# Altium schematic sheet Sheet2.SchDoc
size A3
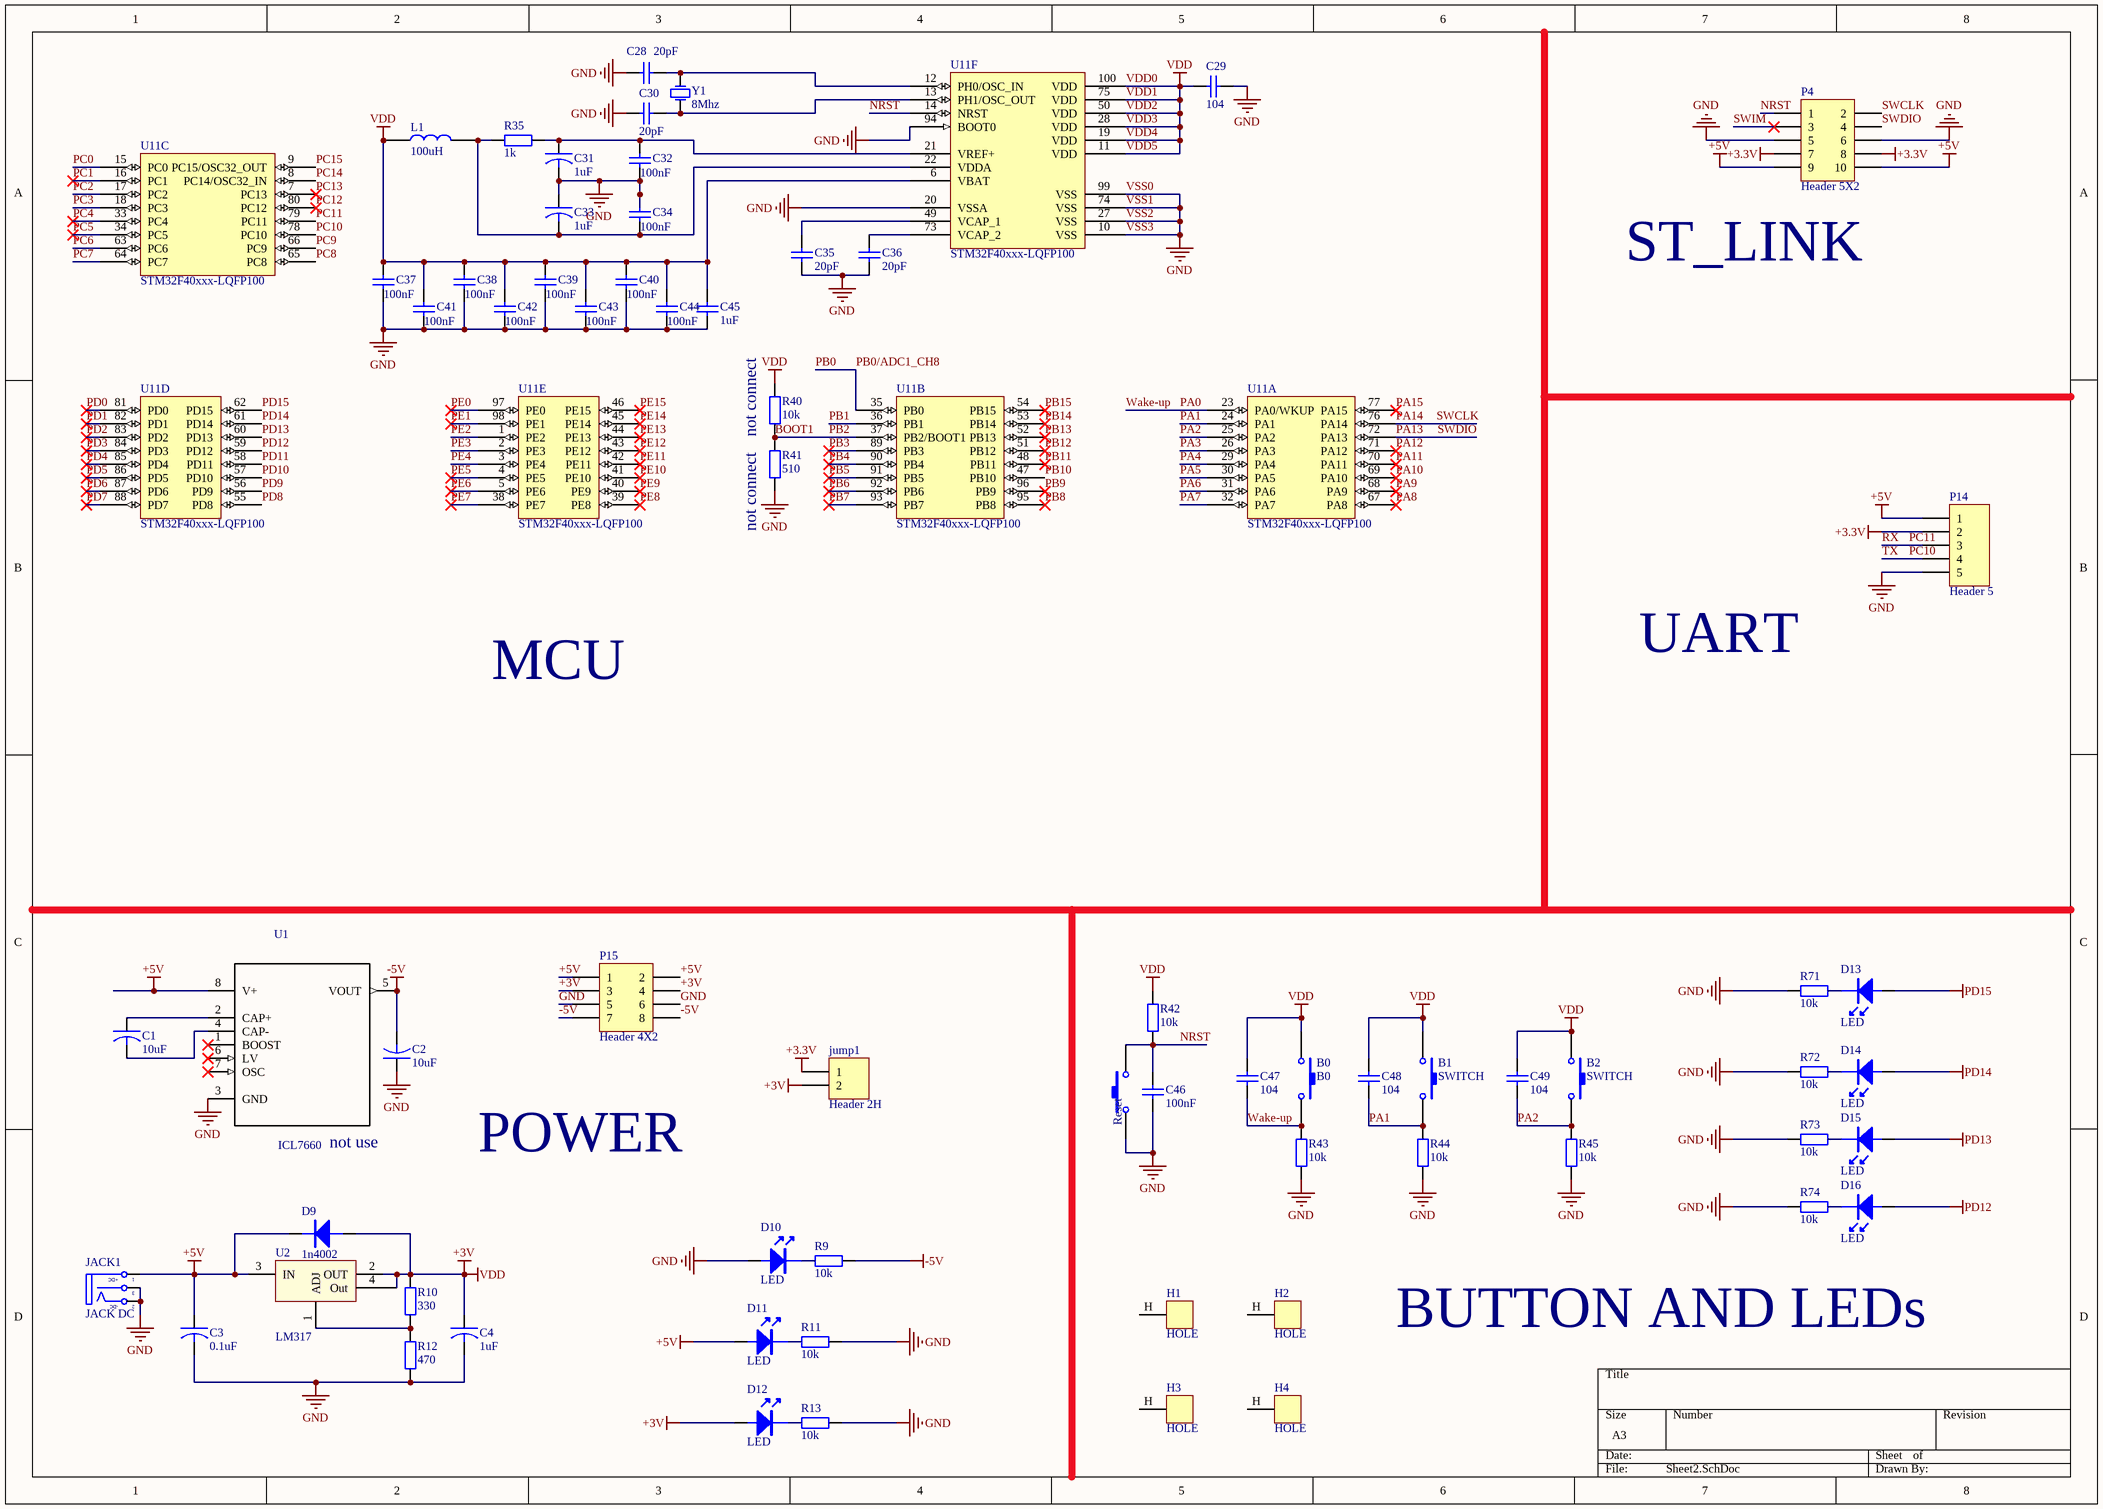
[diagram p0: Sheet2.SchDoc]

## Parts
B0  B0  [SW 4PIN]
B1  SWITCH  [SW 4PIN]
B2  SWITCH  [SW 4PIN]
C1  10uF  [3.5X2.8X1.9]
C2  10uF  [3.5X2.8X1.9]
C3  0.1uF  [3.5X2.8X1.9]
C4  1uF  [3.5X2.8X1.9]
C28  20pF  [0805 CAP]
C29  104  [0805 CAP]
C30  20pF  [0805 CAP]
C31  1uF  [3.5X2.8X1.9]
C32  100nF  [0805 CAP]
C33  1uF  [3.5X2.8X1.9]
C34  100nF  [0805 CAP]
C35  20pF  [0805 CAP]
C36  20pF  [0805 CAP]
C37  100nF  [0805 CAP]
C38  100nF  [0805 CAP]
C39  100nF  [0805 CAP]
C40  100nF  [0805 CAP]
C41  100nF  [0805 CAP]
C42  100nF  [0805 CAP]
C43  100nF  [0805 CAP]
C44  100nF  [0805 CAP]
C45  1uF  [0805 CAP]
C46  100nF  [0805 CAP]
C47  104  [0805 CAP]
C48  104  [0805 CAP]
C49  104  [0805 CAP]
D9  1n4002  [DIODE SMA]
D10  LED  [LED SMD 0805]
D11  LED  [LED SMD 0805]
D12  LED  [LED SMD 0805]
D13  LED  [LED SMD 0805]
D14  LED  [LED SMD 0805]
D15  LED  [LED SMD 0805]
D16  LED  [LED SMD 0805]
H1  HOLE  [HOLE]
H2  HOLE  [HOLE]
H3  HOLE  [HOLE]
H4  HOLE  [HOLE]
JACK1  JACK DC  [JACK DC]
jump1  Header 2H  [HDR1X2]
L1  100uH  [1206 Negro]
P4  Header 5X2  [HDR2X5 2mm]
P14  Header 5  [HDR1X5]
P15  Header 4X2  [HDR2X4]
R9  10k  [0805 RESISTOR]
R10  330  [0805 RESISTOR]
R11  10k  [0805 RESISTOR]
R12  470  [0805 RESISTOR]
R13  10k  [0805 RESISTOR]
R35  1k  [0805 RESISTOR]
R40  10k  [0805 RESISTOR]
R41  510  [0805 RESISTOR]
R42  10k  [0805 RESISTOR]
R43  10k  [0805 RESISTOR]
R44  10k  [0805 RESISTOR]
R45  10k  [0805 RESISTOR]
R71  10k  [0805 RESISTOR]
R72  10k  [0805 RESISTOR]
R73  10k  [0805 RESISTOR]
R74  10k  [0805 RESISTOR]
Reset  (no value)  [SW 4PIN]
U1  ICL7660  [SOIC 8PIN]
U2  LM317  [SOT223-4N]
U11  STM32F40xxx-LQFP100  [LQFP 100PIN]  (parts A,B,C,D,E,F of 6)
Y1  8Mhz  [CRYSTAL DIP]

## Nets
+3.3V: jump1.1 P4.7 P4.8 P14.2
+3V: B0.1 B1.1 B2.1 C4.1 C29.1 C37.2 C38.2 C39.2 C40.2 C41.2 C42.2 C43.2 C44.2 C45.2 C47.2 C48.2 C49.2 D9.1 D12.1 jump1.2 L1.1 P15.3 P15.4 R10.1 R40.2 R42.1 U2.2(OUT) U2.4(Out) U11.6(VBAT) U11.11(VDD) U11.19(VDD) U11.28(VDD) U11.50(VDD) U11.75(VDD) U11.100(VDD)  [also labelled VDD, VDD0, VDD1, VDD2, VDD3, VDD4, VDD5]
+5V: C3.1 D9.2 D11.1 JACK1.1(T) P4.9 P4.10 P14.1 P15.1 P15.2 U1.8(V+) U2.3(IN)
-5V: C2.2 P15.7 P15.8 R9.2 U1.5(VOUT)
GND: C2.1 C3.2 C4.2 C28.1 C29.2 C30.1 C31.2 C32.1 C33.1 C34.2 C35.1 C36.1 C37.1 C38.1 C39.1 C40.1 C41.1 C42.1 C43.1 C44.1 C45.1 C46.2 D10.1 JACK1.2(TN) JACK1.3(S) P4.5 P4.6 P14.5 P15.5 P15.6 R11.2 R12.2 R13.2 R41.1 R43.1 R44.1 R45.1 R71.2 R72.2 R73.2 R74.2 Reset.1 U1.3(GND) U11.10(VSS) U11.20(VSSA) U11.27(VSS) U11.74(VSS) U11.94(BOOT0) U11.99(VSS)  [also labelled VSS0, VSS1, VSS2, VSS3]
PD12: D16.1 U11.59(PD12)
PD13: D15.1 U11.60(PD13)
PD14: D14.1 U11.61(PD14)
PD15: D13.1 U11.62(PD15)
BOOT1: R40.1 R41.2 U11.37(PB2/BOOT1)  [also labelled PB2]
NRST: C46.1 P4.1 R42.2 Reset.2 U11.14(NRST)
PA0: B0.2 C47.1 R43.2 U11.23(PA0/WKUP)  [also labelled Wake-up]
PA1: B1.2 C48.1 R44.2 U11.24(PA1)
PA2: B2.2 C49.1 R45.2 U11.25(PA2)
PA3: U11.26(PA3)
PA4: U11.29(PA4)
PA5: U11.30(PA5)
PA6: U11.31(PA6)
PA7: U11.32(PA7)
PA8: U11.67(PA8)
PA9: U11.68(PA9)
PA10: U11.69(PA10)
PA11: U11.70(PA11)
PA12: U11.71(PA12)
PA13: P4.4 U11.72(PA13)  [also labelled SWDIO]
PA14: P4.2 U11.76(PA14)  [also labelled SWCLK]
PA15: U11.77(PA15)
PB0: U11.35(PB0)  [also labelled PB0/ADC1_CH8]
PB1: U11.36(PB1)
PB3: U11.89(PB3)
PB4: U11.90(PB4)
PB5: U11.91(PB5)
PB6: U11.92(PB6)
PB7: U11.93(PB7)
PB8: U11.95(PB8)
PB9: U11.96(PB9)
PB10: U11.47(PB10)
PB11: U11.48(PB11)
PB12: U11.51(PB12)
PB13: U11.52(PB13)
PB14: U11.53(PB14)
PB15: U11.54(PB15)
PC0: U11.15(PC0)
PC1: U11.16(PC1)
PC2: U11.17(PC2)
PC3: U11.18(PC3)
PC4: U11.33(PC4)
PC5: U11.34(PC5)
PC6: U11.63(PC6)
PC7: U11.64(PC7)
PC8: U11.65(PC8)
PC9: U11.66(PC9)
PC10: P14.4 U11.78(PC10)  [also labelled TX]
PC11: P14.3 U11.79(PC11)  [also labelled RX]
PC12: U11.80(PC12)
PC13: U11.7(PC13)
PC14: U11.8(PC14/OSC32_IN)
PC15: U11.9(PC15/OSC32_OUT)
PD0: U11.81(PD0)
PD1: U11.82(PD1)
PD2: U11.83(PD2)
PD3: U11.84(PD3)
PD4: U11.85(PD4)
PD5: U11.86(PD5)
PD6: U11.87(PD6)
PD7: U11.88(PD7)
PD8: U11.55(PD8)
PD9: U11.56(PD9)
PD10: U11.57(PD10)
PD11: U11.58(PD11)
PE0: U11.97(PE0)
PE1: U11.98(PE1)
PE2: U11.1(PE2)
PE3: U11.2(PE3)
PE4: U11.3(PE4)
PE5: U11.4(PE5)
PE6: U11.5(PE6)
PE7: U11.38(PE7)
PE8: U11.39(PE8)
PE9: U11.40(PE9)
PE10: U11.41(PE10)
PE11: U11.42(PE11)
PE12: U11.43(PE12)
PE13: U11.44(PE13)
PE14: U11.45(PE14)
PE15: U11.46(PE15)
SWIM: P4.3
NetC1_1: C1.1 U1.2(CAP+)
NetC1_2: C1.2 U1.4(CAP-)
NetC28_2: C28.2 U11.12(PH0/OSC_IN) Y1.2(OSC2)
NetC30_2: C30.2 U11.13(PH1/OSC_OUT) Y1.1(OSC1)
NetC31_1: C31.1 C32.2 R35.2 U11.21(VREF+)
NetC33_2: C33.2 C34.1 L1.2 R35.1 U11.22(VDDA)
NetC35_2: C35.2 U11.49(VCAP_1)
NetC36_2: C36.2 U11.73(VCAP_2)
NetD10_2: D10.2 R9.1
NetD11_2: D11.2 R11.1
NetD12_2: D12.2 R13.1
NetD13_2: D13.2 R71.1
NetD14_2: D14.2 R72.1
NetD15_2: D15.2 R73.1
NetD16_2: D16.2 R74.1
NetR10_2: R10.2 R12.1 U2.1(ADJ)

Not connected (* = marked no-connect by the designer): H1 H(HOLE); H2 H(HOLE); H3 H(HOLE); H4 H(HOLE); U1 1(BOOST)* 6(LV)* 7(OSC)*

## Notes on the sheet
- (near P4) ST_LINK
- not connect
- MCU
- UART
- (near U1) not use
- POWER
- BUTTON AND LEDs
- (in symbol JACK DC) +DC; -DC

## Library data of the parts
B0 Reset = SWITCH: Published: 24-Mar-1999; LatestRevisionDate: 17-Jul-2002; LatestRevisionNote: Re-released for DXP Platform.; PackageReference: SPST-2; Publisher: Altium Limited
C1-C4 C31 C33 = CAPACITOR
C28-C30 C32 C34-C49 = CAP CERAMIC: Published: 8-Jun-2000; LatestRevisionDate: 17-Jul-2002; LatestRevisionNote: Re-released for DXP Platform.; PackageReference: RAD-0.3; Publisher: Altium Limited
D9 = DIODE
JACK1 = JACK DC: Value: Jac DC
L1 = INDUCTOR
R9-R13 R35 R40-R45 R71-R74 = RESISTOR: Value: R1/4W - 1K
U1 = ICL7660SIBAZ: ICL7660 Series 1.5 - 12 Vin 45 mA 10-35 kHz CMOS Voltage Converter - SOIC-8; MF: Renesas Electronics; Availability: Unavailable; Package: SOIC-8 Intersil; Price: None; SnapEDA_Link: https://www.snapeda.com/parts/ICL7660SIBAZ/Renesas%20Electronics%20America%20Inc./view-part/?ref=snap; MP: ICL7660SIBAZ; Value: *
Y1 = Crystal: Published: 8-Jun-2000; LatestRevisionDate: 17-Jul-2002; LatestRevisionNote: Re-released for DXP Platform.; PackageReference: R38; Publisher: Altium Limited
B1 B2 = SWITCH: Published: 24-Mar-1999; LatestRevisionDate: 17-Jul-2002; LatestRevisionNote: Re-released for DXP Platform.; PackageReference: SPST-2; Publisher: Altium Limited
jump1 = Header 2H: LatestRevisionDate: 17-Jul-2002; LatestRevisionNote: Re-released for DXP Platform.; Publisher: Altium Limited
P4 = Header 5X2: LatestRevisionDate: 17-Jul-2002; LatestRevisionNote: Re-released for DXP Platform.; Publisher: Altium Limited
P14 = Header 5: LatestRevisionDate: 17-Jul-2002; LatestRevisionNote: Re-released for DXP Platform.; Publisher: Altium Limited
P15 = Header 4X2: LatestRevisionDate: 17-Jul-2002; LatestRevisionNote: Re-released for DXP Platform.; Publisher: Altium Limited
U2 = LM317: Value: LM317